# Altium project mb1045.PrjPCB (part 3 of 3)

## Sheet Ethernet.SchDoc
size A4; Revision: B.2(PCB.SCH)
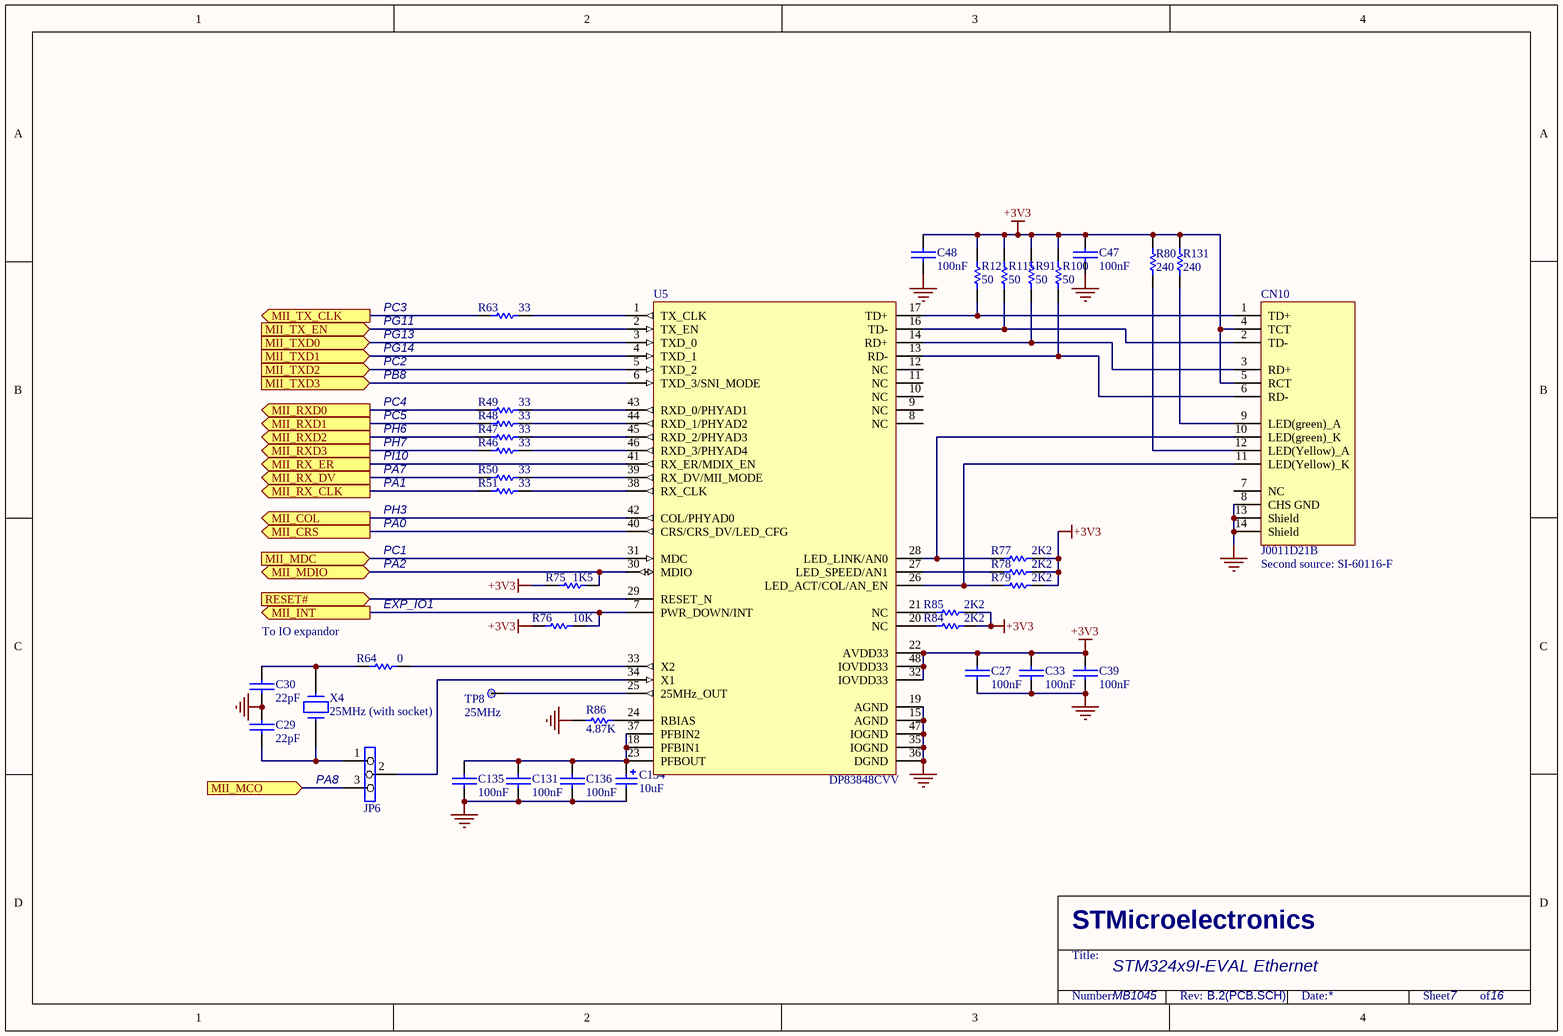
[diagram p15: Ethernet.SchDoc]

### Parts
C27  100nF  [0603C]
C29  22pF  [0603C]
C30  22pF  [0603C]
C33  100nF  [0603C]
C39  100nF  [0603C]
C47  100nF  [0603C]
C48  100nF  [0603C]
C131  100nF  [0603C]
C134  10uF  [TAN-A]
C135  100nF  [0603C]
C136  100nF  [0603C]
CN10  J0011D21B  [RJ45_J0011D01BNL]
JP6  (no value)  [SIP3]
R46  33  [0603R]
R47  33  [0603R]
R48  33  [0603R]
R49  33  [0603R]
R50  33  [0603R]
R51  33  [0603R]
R63  33  [0603R]
R64  0  [0603R]
R75  1K5  [0603R]
R76  10K  [0603R]
R77  2K2  [0603R]
R78  2K2  [0603R]
R79  2K2  [0603R]
R80  240  [0603R]
R84  2K2  [0603R]
R85  2K2  [0603R]
R86  4.87K  [0603R]
R91  50  [0603R]
R100  50  [0603R]
R115  50  [0603R]
R121  50  [0603R]
R131  240  [0603R]
TP8  25MHz  [TP]
U5  DP83848CVV  [LQFP48_0R5_9X9]
X4  25MHz (with socket)  [XTAL_socket]

### Ports
MII_COL (out), MII_CRS (out), MII_INT (out), MII_MCO (in), MII_MDC (in), MII_MDIO (bidir), MII_RX_CLK (out), MII_RX_DV (out), MII_RX_ER (out), MII_RXD0 (out), MII_RXD1 (out), MII_RXD2 (out), MII_RXD3 (out), MII_TX_CLK (out), MII_TX_EN (in), MII_TXD0 (in), MII_TXD1 (in), MII_TXD2 (in), MII_TXD3 (in), RESET# (in)

### Nets
+3V3: C27.1 C33.2 C39.2 C47.2 C48.2 CN10.4(TCT) CN10.5(RCT) R75.2 R76.1 R77.2 R78.2 R79.2 R80.2 R84.2 R85.2 R91.1 R100.1 R115.1 R121.1 R131.2 U5.22(AVDD33) U5.32(IOVDD33) U5.48(IOVDD33)
GND: C27.2 C29.2 C30.1 C33.1 C39.1 C47.1 C48.1 C131.1 C134.2 C135.2 C136.1 CN10.8(CHS_GND) CN10.13(Shield) CN10.14(Shield) R86.1 U5.15(AGND) U5.19(AGND) U5.35(IOGND) U5.36(DGND) U5.47(IOGND)
PH6: R47.2 ; port MII_RXD2
PH7: R46.2 ; port MII_RXD3
RESET#: U5.29(RESET_N) ; port RESET#
NetC29_1: C29.1 JP6.1 X4.1
NetC30_2: C30.2 R64.2 X4.2
NetC131_2: C131.2 C134.1 C135.1 C136.2 U5.18(PFBIN1) U5.23(PFBOUT) U5.37(PFBIN2)
NetCN10_1: CN10.1(TD+) R121.2 U5.17(TD+)
NetCN10_2: CN10.2(TD-) R115.2 U5.16(TD-)
NetCN10_3: CN10.3(RD+) R91.2 U5.14(RD+)
NetCN10_6: CN10.6(RD-) R100.2 U5.13(RD-)
NetCN10_9: CN10.9(LED(green)_A) R131.1
NetCN10_10: CN10.10(LED(green)_K) R77.1 U5.28(LED_LINK/AN0)
NetCN10_11: CN10.11(LED(Yellow)_K) R79.1 U5.26(LED_ACT/COL/AN_EN)
NetCN10_12: CN10.12(LED(Yellow)_A) R80.1
NetJP6_2: JP6.2 U5.34(X1)
NetJP6_3: JP6.3 ; port MII_MCO
NetR43_1: U5.41(RX_ER/MDIX_EN) ; port MII_RX_ER
NetR46_1: R46.1 U5.46(RXD_3/PHYAD4)
NetR47_1: R47.1 U5.45(RXD_2/PHYAD3)
NetR48_1: R48.1 U5.44(RXD_1/PHYAD2)
NetR48_2: R48.2 ; port MII_RXD1
NetR49_1: R49.1 U5.43(RXD_0/PHYAD1)
NetR49_2: R49.2 ; port MII_RXD0
NetR50_1: R50.1 U5.39(RX_DV/MII_MODE)
NetR50_2: R50.2 ; port MII_RX_DV
NetR51_1: R51.1 U5.38(RX_CLK)
NetR51_2: R51.2 ; port MII_RX_CLK
NetR63_1: R63.1 U5.1(TX_CLK)
NetR63_2: R63.2 ; port MII_TX_CLK
NetR64_1: R64.1 U5.33(X2)
NetR75_1: R75.1 U5.30(MDIO) ; port MII_MDIO
NetR76_2: R76.2 U5.7(PWR_DOWN/INT) ; port MII_INT
NetR78_1: R78.1 U5.27(LED_SPEED/AN1)
NetR84_1: R84.1 U5.20(NC)
NetR85_1: R85.1 U5.21(NC)
NetR86_2: R86.2 U5.24(RBIAS)
NetR222_1: U5.31(MDC) ; port MII_MDC
NetR228_1: U5.5(TXD_2) ; port MII_TXD2
NetR233_2: U5.3(TXD_0) ; port MII_TXD0
NetR236_2: U5.4(TXD_1) ; port MII_TXD1
NetR243_1: U5.6(TXD_3/SNI_MODE) ; port MII_TXD3
NetR249_2: U5.2(TX_EN) ; port MII_TX_EN
NetSB7_1: U5.40(CRS/CRS_DV/LED_CFG) ; port MII_CRS
NetSB8_2: U5.42(COL/PHYAD0) ; port MII_COL
NetTP8_1: TP8.1 U5.25(25MHz_OUT)

Not connected (* = marked no-connect by the designer): CN10 7(NC); U5 8(NC) 9(NC) 10(NC) 11(NC) 12(NC)

### Notes on the sheet
- PC3
- PG11
- PG13
- PG14
- PC2
- PB8
- PC4
- PC5
- PH6
- PH7
- PI10
- PA7
- PH3
- PA1
- PA0
- PC1
- PA2
- (near CN10) Second source: SI-60116-F
- To IO expandor
- EXP_IO1
- (near JP6) PA8
- STM324x9I-EVAL Ethernet
- MB1045
- 7
- 16
- STMicroelectronics
- Title:
- Number:
- Rev:
- Date:
- Sheet          of

### Library data of the parts
C27 C29 C30 C33 C39 C47 C48 C131 C135 C136 = CAP: Capacitor
C134 = Cap Pol1: Polarized Capacitor (Radial); Published: 8-Jun-2000; Revision: July-2002: Re-released for DXP Platform.; Publisher: Altium Limited; Value: 10uF
JP6 = Jumper3
R46-R51 R63 R64 R75-R80 R84-R86 R91 R100 R115 R121 R131 = Res1: Resistor; Value: 1K; Published: 8-Jun-2000; Revision: July-2002: Re-released for DXP Platform.; Publisher: Altium Limited
TP8 = TP
X4 = CRYSTAL

## Nets that join several sheets
+1V8: Audio (6 pins), Power (C56.1 TP12.1 U13.2 U13.4), LCD&Camera&Connectors (8 pins)
+2V8: Power (5 pins), LCD&Camera&Connectors (8 pins)
+3V3: mb1045 (R171.1 R173.1), Audio (11 pins), JTAG&Trace (8 pins), MCU (JP8.1 R22.2 SW1.1 SW2.1), Memory (45 pins), MotorControl (CN1.28 R15.2), Peripherals (15 pins), Power (11 pins), RS232&IrDA (8 pins), ST_LINK (15 pins), USB_OTG (15 pins), USB_OTG_FS (R118.2 R133.2 R134.1), CAN&MicroSDD&IO_Expandor (17 pins), ExtensionConnector (CN6.48 CN7.48 CN12.40), LCD&Camera&Connectors (CN3.5 CN20.50 R216.1), Ethernet (23 pins)
+5V: MotorControl (CN1.25), Power (11 pins), USB_OTG (U6.5), USB_OTG_FS (U9.5), ExtensionConnector (CN6.60 CN7.60), LCD&Camera&Connectors (CN2.8 CN3.8 L5.1)
D5V: Power (JP12.7), ExtensionConnector (CN6.49 CN7.49)
GND: Audio (39 pins), JTAG&Trace (27 pins), MCU (64 pins), Memory (40 pins), MotorControl (27 pins), Peripherals (18 pins), Power (16 pins), RS232&IrDA (14 pins), ST_LINK (26 pins), USB_OTG (38 pins), USB_OTG_FS (12 pins), CAN&MicroSDD&IO_Expandor (18 pins), ExtensionConnector (22 pins), LCD&Camera&Connectors (34 pins), Ethernet (20 pins)
U5V_ST_LINK: Power (JP12.11), ST_LINK (C163.1 CN21.1 D8.5 R304.1)
VBUS_FS1: MCU (R266.2), Power (JP12.3), USB_OTG_FS (5 pins), ExtensionConnector (CN7.54)
VBUS_FS2: MCU (R264.1), Power (JP12.5), USB_OTG (CN15.1 D6.B3 R83.1 R137.1)
VBUS_HS: Power (JP12.1), USB_OTG (CN9.1 D3.A1 L2.2)
VDD_MCU: MCU (41 pins), Power (5 pins)
A0: MCU (R231.2), Memory (U8.E2 U10.G8 U11.A3), ExtensionConnector (CN12.14)
A1: MCU (R226.2), Memory (U8.D2 U10.G9 U11.A4), ExtensionConnector (CN12.12)
A2: MCU (R224.2), Memory (U8.C2 U10.F7 U11.A5), ExtensionConnector (CN12.8)
A3: MCU (R221.2), Memory (U8.A2 U10.F3 U11.B3), ExtensionConnector (CN12.5)
A4: MCU (R217.2), Memory (U8.B2 U10.G1 U11.B4), ExtensionConnector (CN12.3)
A5: MCU (R213.2), Memory (U8.D3 U10.G2 U11.C3), ExtensionConnector (CN12.1)
A6: MCU (R253.2), Memory (U8.C3 U10.G3 U11.C4), ExtensionConnector (CN11.5)
A7: MCU (R250.2), Memory (U8.A3 U10.H1 U11.D4), ExtensionConnector (CN11.3)
A8: MCU (R254.2), Memory (U8.B6 U10.H2 U11.H2), ExtensionConnector (CN11.4)
A9: MCU (R273.2), Memory (U8.A6 U10.J3 U11.H3), ExtensionConnector (CN11.18)
A10: MCU (R258.2), Memory (U8.C6 U10.G7 U11.H4), ExtensionConnector (CN11.6)
A11: MCU (R257.2), Memory (U8.D6 U10.H9 U11.H5), ExtensionConnector (CN11.7)
A12: MCU (R285.2), Memory (U8.B7 U11.G3), ExtensionConnector (CN11.33)
A13: MCU (R269.2), Memory (U8.A7 U11.G4), ExtensionConnector (CN11.34)
A14: MCU (R286.2), Memory (U8.C7 U10.J7 U11.F3), ExtensionConnector (CN11.28)
A15: MCU (R271.2), Memory (U8.D7 U10.H8 U11.F4), ExtensionConnector (CN11.25)
A16: MCU (R272.1), Memory (U8.E7 U11.E4), ExtensionConnector (CN11.21)
A17: MCU (R287.2), Memory (U8.B3 U11.D3), ExtensionConnector (CN11.23)
A18: MCU (R270.2), Memory (U8.C4 U11.H1), ExtensionConnector (CN11.31)
A19: MCU (R36.2 R37.2), Memory (U8.D5 U11.G2), ExtensionConnector (CN12.13)
A20: MCU (R34.2 R35.2), Memory (U8.D4 U11.H6), ExtensionConnector (CN12.11)
A21: MCU (R24.2 R29.2), Memory (U8.C5), ExtensionConnector (CN12.4)
A22: MCU (R30.2 R32.2), Memory (U8.B8), ExtensionConnector (CN12.7)
A23: MCU (R40.2 R41.2), Memory (U8.C8), ExtensionConnector (CN12.16)
D0: MCU (R74.2), Memory (U8.E3 U10.R8 U11.B6), ExtensionConnector (CN11.39)
D1: MCU (R61.2), Memory (U8.H3 U10.N7 U11.C5), ExtensionConnector (CN11.38)
D2: MCU (R274.2), Memory (U8.E4 U10.R9 U11.C6), ExtensionConnector (CN12.31)
D3: MCU (R288.2), Memory (U8.H4 U10.N8 U11.D5), ExtensionConnector (CN12.32)
D4: MCU (R65.2), Memory (U8.H5 U10.P9 U11.E5), ExtensionConnector (CN11.11)
D5: MCU (R54.2), Memory (U8.E5 U10.M8 U11.F5), ExtensionConnector (CN11.14)
D6: MCU (R53.2), Memory (U8.H6 U10.M7 U11.F6), ExtensionConnector (CN11.12)
D7: MCU (R66.2), Memory (U8.E6 U10.L8 U11.G6), ExtensionConnector (CN11.13)
D8: MCU (R55.2), Memory (U8.F3 U10.L2 U11.B1), ExtensionConnector (CN11.16)
D9: MCU (R67.2), Memory (U8.G3 U10.M3 U11.C1), ExtensionConnector (CN11.15)
D10: MCU (R69.2), Memory (U8.F4 U10.M2 U11.C2), ExtensionConnector (CN11.19)
D11: MCU (R56.2), Memory (U8.G4 U10.P1 U11.D2), ExtensionConnector (CN11.20)
D12: MCU (R68.2), Memory (U8.F5 U10.N2 U11.E2), ExtensionConnector (CN11.17)
D13: MCU (R60.2), Memory (U8.G6 U10.R1 U11.F2), ExtensionConnector (CN11.35)
D14: MCU (R72.2), Memory (U8.F6 U10.N3 U11.F1), ExtensionConnector (CN11.37)
D15: MCU (R73.2), Memory (U8.G7 U10.R2 U11.G1), ExtensionConnector (CN11.36)
D16: MCU (R57.1), Memory (U10.E8), ExtensionConnector (CN11.22)
D17: MCU (R58.1), Memory (U10.D7), ExtensionConnector (CN11.26)
D18: MCU (R70.1), Memory (U10.D8), ExtensionConnector (CN11.24)
D19: MCU (R71.1), Memory (U10.B9), ExtensionConnector (CN11.27)
D20: MCU (R59.1), Memory (U10.C8), ExtensionConnector (CN11.32)
D21: MCU (R278.1), Memory (U10.A9), ExtensionConnector (CN12.39)
D22: MCU (R291.1), Memory (U10.C7), ExtensionConnector (CN12.38)
D23: MCU (R290.1), Memory (U10.A8), ExtensionConnector (CN12.36)
D24: MCU (R277.1), Memory (U10.A2), ExtensionConnector (CN12.37)
D25: MCU (R276.1), Memory (U10.C3), ExtensionConnector (CN12.35)
D26: MCU (R275.1), Memory (U10.A1), ExtensionConnector (CN12.33)
D27: MCU (R289.1), Memory (U10.C2), ExtensionConnector (CN12.34)
D28: MCU (R247.1), Memory (U10.B1), ExtensionConnector (CN12.22)
D29: MCU (R237.1), Memory (U10.D2), ExtensionConnector (CN12.18)
D30: MCU (R241.1), Memory (U10.D3), ExtensionConnector (CN12.20)
D31: MCU (R244.1), Memory (U10.E2), ExtensionConnector (CN12.21)
I2C1_SCL: mb1045 (R173.2), Audio (U17.H1), MCU (U3.B6), CAN&MicroSDD&IO_Expandor (U16.19), ExtensionConnector (CN7.18), LCD&Camera&Connectors (CN20.40 R4.1 R6.1 TR1.3)
I2C1_SDA: mb1045 (R171.2), Audio (U17.F3), MCU (U3.B4), CAN&MicroSDD&IO_Expandor (U16.20), ExtensionConnector (CN7.14), LCD&Camera&Connectors (CN20.38 R3.1 R7.1 TR2.3)
I2S3_CK: MCU (JP4.3 R292.2 U3.H15), ExtensionConnector (CN7.58), LCD&Camera&Connectors (CN5.23)
LCD_B0: MCU (U3.B10), ExtensionConnector (CN7.27), LCD&Camera&Connectors (CN20.21)
LCD_B1: MCU (U3.B9), ExtensionConnector (CN7.26), LCD&Camera&Connectors (CN20.23)
LCD_B2: MCU (U3.C9), ExtensionConnector (CN7.20), LCD&Camera&Connectors (CN20.25)
LCD_B3: MCU (U3.D10), ExtensionConnector (CN7.22), LCD&Camera&Connectors (CN20.27)
LCD_B4: MCU (U3.D8), ExtensionConnector (CN7.16), LCD&Camera&Connectors (CN20.29)
LCD_B5: MCU (U3.D7), ExtensionConnector (CN7.13), LCD&Camera&Connectors (CN20.31)
LCD_B6: MCU (U3.C6), ExtensionConnector (CN7.12), LCD&Camera&Connectors (CN20.33)
LCD_B7: MCU (U3.C5), ExtensionConnector (CN7.11), LCD&Camera&Connectors (CN20.35)
LCD_G0: MCU (U3.J12), ExtensionConnector (CN6.53), LCD&Camera&Connectors (CN20.4)
LCD_G1: MCU (U3.H12), ExtensionConnector (CN6.57), LCD&Camera&Connectors (CN20.6)
LCD_G2: MCU (U3.J13), ExtensionConnector (CN6.45), LCD&Camera&Connectors (CN20.8)
LCD_G3: MCU (U3.H13), ExtensionConnector (CN6.55), LCD&Camera&Connectors (CN20.10)
LCD_G4: MCU (U3.G12), ExtensionConnector (CN7.35), LCD&Camera&Connectors (CN20.12)
LCD_G5: MCU (U3.G13), ExtensionConnector (CN7.37), LCD&Camera&Connectors (CN20.14)
LCD_G6: MCU (U3.F12), ExtensionConnector (CN7.34), LCD&Camera&Connectors (CN20.16)
LCD_G7: MCU (U3.F13), ExtensionConnector (CN7.38), LCD&Camera&Connectors (CN20.18)
LCD_R0: MCU (U3.G4), ExtensionConnector (CN7.5), LCD&Camera&Connectors (CN20.3)
LCD_R1: MCU (U3.R6), ExtensionConnector (CN6.54), LCD&Camera&Connectors (CN20.5)
LCD_R2: MCU (U3.R7), ExtensionConnector (CN6.58), LCD&Camera&Connectors (CN20.7)
LCD_R3: MCU (U3.P7), ExtensionConnector (CN6.56), LCD&Camera&Connectors (CN20.9)
LCD_R4: MCU (U3.N8), ExtensionConnector (CN6.31), LCD&Camera&Connectors (CN20.11)
LCD_R5: MCU (U3.M9), ExtensionConnector (CN6.34), LCD&Camera&Connectors (CN20.13)
LCD_R6: MCU (U3.M14), ExtensionConnector (CN6.42), LCD&Camera&Connectors (CN20.15)
LCD_R7: MCU (U3.K12), ExtensionConnector (CN6.44), LCD&Camera&Connectors (CN20.17)
NetB4_1: Peripherals (B4.1 C95.2 R198.2), CAN&MicroSDD&IO_Expandor (U16.14)
NetB4_2: Peripherals (B4.2 C94.2 R197.2), CAN&MicroSDD&IO_Expandor (U16.16)
NetB4_3: Peripherals (B4.3 C93.2 R196.2), CAN&MicroSDD&IO_Expandor (U16.15)
NetB4_4: Peripherals (B4.4 C97.2 R200.2), CAN&MicroSDD&IO_Expandor (U16.13)
NetB4_6: Peripherals (B4.6 C96.2 R199.2), CAN&MicroSDD&IO_Expandor (U16.12)
NetC6_2: MCU (R223.2), MotorControl (C6.2 CN1.31 SB2.2)
NetC7_2: MCU (R252.2), MotorControl (C7.2 CN1.27 SB1.2)
NetC8_2: MCU (R210.2), MotorControl (C8.2 CN1.33)
NetC9_2: MCU (R215.2), MotorControl (C9.2 CN1.34)
NetC10_2: MCU (R255.2), MotorControl (C10.2 CN1.29)
NetC11_1: MCU (R263.1), MotorControl (C11.1 R9.2)
NetC12_2: MCU (R242.1), MotorControl (C12.2 R10.1)
NetC13_2: MCU (R232.1), MotorControl (C13.2 R11.1)
NetC14_2: MCU (R218.1), MotorControl (C14.2 R12.1)
NetC15_1: MCU (R235.1), MotorControl (C15.1 R13.2 R14.1)
NetC18_2: MCU (R268.2), MotorControl (C18.2 SB1.1)
NetCN1_3: MCU (R292.1), MotorControl (CN1.3)
NetCN1_5: MCU (R225.2), MotorControl (CN1.5)
NetCN1_9: MCU (R282.1), MotorControl (CN1.9)
NetCN1_11: MCU (R280.1), MotorControl (CN1.11)
NetCN1_13: MCU (R234.1), MotorControl (CN1.13)
NetCN1_21: MCU (R246.2), MotorControl (CN1.21)
NetCN1_23: MCU (R240.1), MotorControl (CN1.23)
NetCN5_15: CAN&MicroSDD&IO_Expandor (U16.4), LCD&Camera&Connectors (CN5.15 R216.2)
NetCN12_6: MCU (JP5.1), Memory (R94.1 U8.A4), ExtensionConnector (CN12.6)
NetCN13_12: JTAG&Trace (CN13.12), MCU (R38.1)
NetCN13_14: JTAG&Trace (CN13.14 R113.1), MCU (R39.1)
NetCN13_16: JTAG&Trace (CN13.16 R119.1), MCU (R33.1)
NetCN13_18: JTAG&Trace (CN13.18), MCU (R23.1)
NetCN13_20: JTAG&Trace (CN13.20), MCU (R128.1)
NetCN15_4: MCU (R260.1), USB_OTG (CN15.4 D6.A3)
NetCN17_1: MCU (R293.1), CAN&MicroSDD&IO_Expandor (CN17.1 R156.2)
NetCN17_2: MCU (R284.1), CAN&MicroSDD&IO_Expandor (CN17.2 R155.2)
NetCN17_3: MCU (R294.1), CAN&MicroSDD&IO_Expandor (CN17.3 R154.2)
NetCN17_7: MCU (R281.1), CAN&MicroSDD&IO_Expandor (CN17.7 R153.2)
NetCN17_8: MCU (R265.1), CAN&MicroSDD&IO_Expandor (CN17.8 R152.2)
NetCN20_39: CAN&MicroSDD&IO_Expandor (U16.5), LCD&Camera&Connectors (CN20.39)
NetCN20_43: MCU (R283.2), LCD&Camera&Connectors (CN20.43)
NetD5_C3: MCU (R261.2), USB_OTG_FS (D5.C3 R297.2)
NetJP5_3: Audio (JP14.3), MCU (JP5.3)
NetJP6_3: MCU (R279.2), Ethernet (JP6.3)
NetJP15_3: Audio (JP15.3), MCU (R45.2)
NetJP16_2: MCU (JP16.2), CAN&MicroSDD&IO_Expandor (U14.4)
NetR43_1: MCU (R43.1), Ethernet (U5.41)
NetR48_2: MCU (R267.1), Ethernet (R48.2)
NetR49_2: MCU (R239.1), Ethernet (R49.2)
NetR50_2: MCU (R227.2), Ethernet (R50.2)
NetR51_2: MCU (R214.2), Ethernet (R51.2)
NetR63_2: MCU (R238.1), Ethernet (R63.2)
NetR75_1: MCU (R211.2), Ethernet (R75.1 U5.30)
NetR76_2: CAN&MicroSDD&IO_Expandor (U16.2), Ethernet (R76.2 U5.7)
NetR95_2: USB_OTG (R95.2), CAN&MicroSDD&IO_Expandor (U16.11)
NetR120_2: Audio (U17.F2), MCU (R120.2)
NetR124_1: USB_OTG (R124.1), CAN&MicroSDD&IO_Expandor (U16.10)
NetR130_2: USB_OTG_FS (R130.2), CAN&MicroSDD&IO_Expandor (U16.8)
NetR132_1: USB_OTG_FS (R132.1), CAN&MicroSDD&IO_Expandor (U16.7)
NetR193_2: MCU (R219.2), Peripherals (R193.2)
NetR206_2: CAN&MicroSDD&IO_Expandor (U16.3), LCD&Camera&Connectors (R206.2 R207.1)
NetR222_1: MCU (R222.1), Ethernet (U5.31)
NetR228_1: MCU (R228.1), Ethernet (U5.5)
NetR229_2: CAN&MicroSDD&IO_Expandor (U16.1), LCD&Camera&Connectors (R229.2 R230.1)
NetR233_2: MCU (R233.2), Ethernet (U5.3)
NetR236_2: MCU (R236.2), Ethernet (U5.4)
NetR243_1: MCU (R243.1), Ethernet (U5.6)
NetR249_2: MCU (R249.2), Ethernet (U5.2)
NetR256_2: MCU (R256.2), CAN&MicroSDD&IO_Expandor (U14.1)
NetR262_2: MCU (R262.2), RS232&IrDA (U1.3 U4.13)
NetSB7_1: MCU (SB7.1), Ethernet (U5.40)
NetSB8_2: MCU (SB8.2), Ethernet (U5.42)
NetU16_6: Audio (U17.G3), CAN&MicroSDD&IO_Expandor (U16.6)
PA0: MCU (R219.1 R223.1 SB7.2 U3.N3), ExtensionConnector (CN6.15)
PA1: MCU (R210.1 R214.1 U3.N2), ExtensionConnector (CN6.14)
PA2: MCU (R211.1 R215.1 U3.P2), ExtensionConnector (CN6.13)
PA3: MCU (U3.R2), USB_OTG (U7.24), ExtensionConnector (CN6.18)
PA4: MCU (U3.N4), ExtensionConnector (CN6.21), LCD&Camera&Connectors (CN5.31)
PA5: MCU (U3.P4), USB_OTG (R126.2), ExtensionConnector (CN6.24)
PA6: MCU (U3.P3), MotorControl (R16.2), ExtensionConnector (CN6.20), LCD&Camera&Connectors (CN5.33)
PA7: MCU (R225.1 R227.1 U3.R3), ExtensionConnector (CN6.22)
PA8: MCU (R268.1 R279.1 R283.1 U3.F15), ExtensionConnector (CN7.52)
PA9: MCU (R262.1 R266.1 U3.E15), ExtensionConnector (CN7.43)
PA10: MCU (U3.D15), RS232&IrDA (JP7.2), USB_OTG_FS (R117.2), ExtensionConnector (CN7.44)
PA11: MCU (JP16.1 R255.1 U3.C15), USB_OTG_FS (D5.D3 R298.2), ExtensionConnector (CN7.41)
PA12: MCU (R252.1 R256.1 R261.1 U3.B15), ExtensionConnector (CN7.42)
PA13: JTAG&Trace (R90.2), MCU (U3.A15), ST_LINK (U15.25 U15.27), ExtensionConnector (CN7.40)
PA14: JTAG&Trace (R99.2), MCU (U3.A14), ST_LINK (U15.15 U15.26), ExtensionConnector (CN7.36)
PA15: JTAG&Trace (R106.2), MCU (U3.A13), ST_LINK (U15.17), ExtensionConnector (CN7.32)
PAR_D1: MCU (R45.1 U3.G15), MotorControl (CN1.7), ExtensionConnector (CN7.56), LCD&Camera&Connectors (CN5.24)
PAR_D2: MCU (R280.2 R281.2 U3.G14), ExtensionConnector (CN7.51), LCD&Camera&Connectors (CN5.25)
PAR_D3: MCU (R265.2 U3.F14), ExtensionConnector (CN7.46), LCD&Camera&Connectors (CN5.26)
PAR_D4: MCU (R284.2 U3.B13), ExtensionConnector (CN7.53), LCD&Camera&Connectors (CN2.2 CN3.2 CN5.27)
PAR_D5: MCU (U3.C11), ExtensionConnector (CN7.23), LCD&Camera&Connectors (CN5.28)
PAR_D6: MCU (R240.2 R243.2 U3.A7), ExtensionConnector (CN7.31), LCD&Camera&Connectors (CN5.29)
PAR_D7: MCU (R114.1), LCD&Camera&Connectors (CN5.30)
PAR_D8: MCU (R293.2 U3.B14), ExtensionConnector (CN7.55), LCD&Camera&Connectors (CN2.4 CN3.4 CN5.9)
PAR_D9: MCU (U3.A12), CAN&MicroSDD&IO_Expandor (CN17.5), ExtensionConnector (CN7.28), LCD&Camera&Connectors (CN2.6 CN3.6 CN5.10)
PAR_D10: MCU (JP5.2 U3.B11), ExtensionConnector (CN7.47), LCD&Camera&Connectors (CN5.5)
PAR_D11: MCU (R294.2 U3.D12), ExtensionConnector (CN7.57), LCD&Camera&Connectors (CN5.6)
PB0: MCU (R282.2 U3.R5), USB_OTG (R102.2), ExtensionConnector (CN6.52)
PB1: MCU (R234.2 U3.R4), USB_OTG (R104.2), ExtensionConnector (CN6.26)
PB2: MCU (R5.2 U3.M5), ExtensionConnector (CN6.29)
PB3: MCU (JP4.2 U3.A10), ExtensionConnector (CN7.45)
PB4: JTAG&Trace (R127.2), MCU (U3.A9), ST_LINK (U15.19), ExtensionConnector (CN7.24)
PB5: MCU (U3.A8), USB_OTG (U7.17), ExtensionConnector (CN6.4)
PB7: MCU (U3.B5), ExtensionConnector (CN7.21), LCD&Camera&Connectors (CN5.32)
PB10: MCU (U3.P12), USB_OTG (U7.21), ExtensionConnector (CN6.33)
PB11: MCU (U3.R13), USB_OTG (U7.20), ExtensionConnector (CN6.36)
PB12: MCU (R260.2 U3.L13), USB_OTG (R108.2), ExtensionConnector (CN6.41)
PB13: MCU (R264.2 U3.K14), USB_OTG (R112.2), ExtensionConnector (CN6.43)
PB14: MCU (U3.R14), USB_OTG (D6.D3 R302.2), ExtensionConnector (CN6.35)
PB15: MCU (U3.R15), USB_OTG (D6.C3 R300.2), ExtensionConnector (CN6.38)
PC0: MCU (U3.M2), USB_OTG (U7.13), ExtensionConnector (CN6.11)
PC1: MCU (R218.2 R222.2 U3.M3), ExtensionConnector (CN6.16)
PC2: MCU (R228.2 R232.2 U3.M4), ExtensionConnector (CN6.23)
PC3: MCU (R238.2 R242.2 U3.L4), ExtensionConnector (CN6.27)
PC4: MCU (R235.2 R239.2 U3.N5), ExtensionConnector (CN6.25)
PC5: MCU (R263.2 R267.2 U3.P5), ExtensionConnector (CN6.46)
PC13: MCU (U3.D1), Peripherals (R202.2), ExtensionConnector (CN7.6)
PC14: MCU (R19.2 U3.E1), ExtensionConnector (SB3.1)
PC15: MCU (R18.2 U3.F1), ExtensionConnector (SB4.1)
PD4: MCU (U3.D11), Memory (U8.G2 U11.A2), ExtensionConnector (CN12.28)
PD5: MCU (U3.C10), Memory (R110.2), ExtensionConnector (CN12.26)
PD7: MCU (U3.A11), Memory (R93.2), ExtensionConnector (CN12.24)
PE0: MCU (U3.A6), Memory (U10.K9 U11.A1), ExtensionConnector (CN12.25)
PE1: MCU (U3.A5), Memory (U10.K1 U11.B2), ExtensionConnector (CN12.23)
PF6: Audio (U17.E4), MCU (U3.K2), ExtensionConnector (CN6.7)
PF7: Audio (U17.D3), MCU (U3.K1), ExtensionConnector (CN6.8)
PF8: Audio (U17.G1), MCU (U3.L3), ExtensionConnector (CN6.17)
PF9: Audio (U17.E3), MCU (U3.L2), ExtensionConnector (CN6.12)
PF10: MCU (U3.L1), Peripherals (R28.2), ExtensionConnector (CN6.9)
PF11: MCU (R52.2), Memory (U10.J9), ExtensionConnector (CN11.8)
PG6: MCU (U3.J15), Peripherals (R192.1), ExtensionConnector (CN6.51)
PG7: MCU (U3.J14), Peripherals (R191.1), ExtensionConnector (CN6.47)
PG8: MCU (R62.2), Memory (U10.J1), ExtensionConnector (CN11.40)
PG9: MCU (U3.D9), Memory (R147.2), ExtensionConnector (CN12.27)
PG10: MCU (U3.C8), Peripherals (R190.1), ExtensionConnector (CN7.17)
PG11: MCU (R246.1 R249.1 U3.B8), ExtensionConnector (CN7.33)
PG12: MCU (U3.C7), Peripherals (R189.1), ExtensionConnector (CN7.15)
PG13: MCU (R233.1 U3.B3), ExtensionConnector (CN7.25)
PG14: MCU (R236.1 U3.A4), ExtensionConnector (CN7.29)
PG15: MCU (R42.2), Memory (U10.K7), ExtensionConnector (CN12.19)
PH0: MCU (R20.1 U3.G1), ExtensionConnector (SB5.1)
PH1: MCU (C23.1 U3.H1 X2.1), ExtensionConnector (SB6.1)
PH2: MCU (U3.K4), Memory (R301.2), ExtensionConnector (CN12.2)
PH3: MCU (R248.1), Memory (U10.J8), ExtensionConnector (CN11.1)
PH4: MCU (U3.H4), USB_OTG (U7.11), ExtensionConnector (CN6.28)
PH5: MCU (R251.1), Memory (U10.K8), ExtensionConnector (CN11.2)
PH6: MCU (U3.P13), ExtensionConnector (CN6.37), Ethernet (R47.2)
PH7: MCU (U3.N13), ExtensionConnector (CN6.40), Ethernet (R46.2)
PI4: MCU (U3.C3), Memory (U10.F8), ExtensionConnector (CN12.17)
PI5: MCU (U3.D3), Memory (U10.F2), ExtensionConnector (CN12.15)
PI8: MCU (U3.C2), CAN&MicroSDD&IO_Expandor (R167.2 U16.22), ExtensionConnector (CN7.9)
PI11: MCU (U3.F3), USB_OTG (U7.12), ExtensionConnector (CN6.2)
PI12: MCU (U3.E3), ExtensionConnector (CN7.7), LCD&Camera&Connectors (CN20.26)
PI13: MCU (U3.G3), ExtensionConnector (CN7.2), LCD&Camera&Connectors (CN20.28)
PI14: MCU (R295.1), ExtensionConnector (CN6.32), LCD&Camera&Connectors (CN20.32)
PK7: MCU (U3.C4), ExtensionConnector (CN7.8), LCD&Camera&Connectors (R183.2)
RESET#: JTAG&Trace (R109.2), MCU (B1.2 B1.3 C91.2 U3.J1), ST_LINK (U15.18), USB_OTG (R123.2), ExtensionConnector (R208.1), LCD&Camera&Connectors (CN20.36), Ethernet (U5.29)
T_JTDO: JTAG&Trace (R103.2), MCU (JP4.1), ST_LINK (U15.16 U15.31)